# EAGLE design line_sense (EAGLE 5.11)
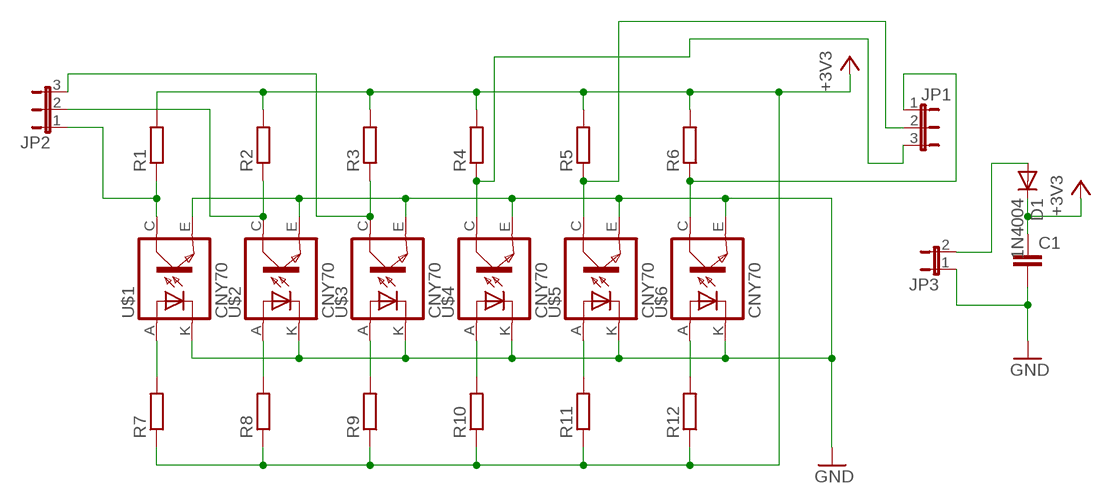
[diagram p0: schematic, sheet 1]

## Parts
C1  C-EUC1206  [C1206]
D1  1N4004  [DO41-10]
JP1  JP2E  [JP2]
JP2  JP2E  [JP2]
JP3  JP1E  [JP1]
R1  R-EU_M1206  [M1206]
R2  R-EU_M1206  [M1206]
R3  R-EU_M1206  [M1206]
R4  R-EU_M1206  [M1206]
R5  R-EU_M1206  [M1206]
R6  R-EU_M1206  [M1206]
R7  R-EU_M1206  [M1206]
R8  R-EU_M1206  [M1206]
R9  R-EU_M1206  [M1206]
R10  R-EU_M1206  [M1206]
R11  R-EU_M1206  [M1206]
R12  R-EU_M1206  [M1206]
U$1  CNY70  [4]
U$2  CNY70  [4]
U$3  CNY70  [4]
U$4  CNY70  [4]
U$5  CNY70  [4]
U$6  CNY70  [4]

## Nets
+3V3: C1.1 D1.C R1.2 R2.2 R3.2 R4.2 R5.2 R6.2 R7.1 R8.1 R9.1 R10.1 R11.1 R12.1
GND: C1.2 JP3.1 U$1.E(EMI) U$1.K(C) U$2.E(EMI) U$2.K(C) U$3.E(EMI) U$3.K(C) U$4.E(EMI) U$4.K(C) U$5.E(EMI) U$5.K(C) U$6.E(EMI) U$6.K(C)
N$2: JP2.2 R2.1 U$2.C(COL)
N$3: JP2.3 R3.1 U$3.C(COL)
N$4: JP1.3 R4.1 U$4.C(COL)
N$5: JP1.2 R5.1 U$5.C(COL)
N$6: JP1.1 R6.1 U$6.C(COL)
N$7: R8.2 U$2.A
N$8: R9.2 U$3.A
N$9: R10.2 U$4.A
N$10: R11.2 U$5.A
N$11: R12.2 U$6.A
N$12: R7.2 U$1.A
N$13: D1.A JP3.2
N$14: JP2.1 R1.1 U$1.C(COL)

## Library data of the parts
C1 = rcl:C-EU: CAPACITOR, European symbol
D1 = diode:1N4004: DIODE general purpose rectifier, 1 A
JP1 JP2 = jumper:JP2E: JUMPER
JP3 = jumper:JP1E: JUMPER
R1-R12 = rcl:R-EU_: RESISTOR, European symbol
U$1-U$6 = cny70:CNY70

## Board
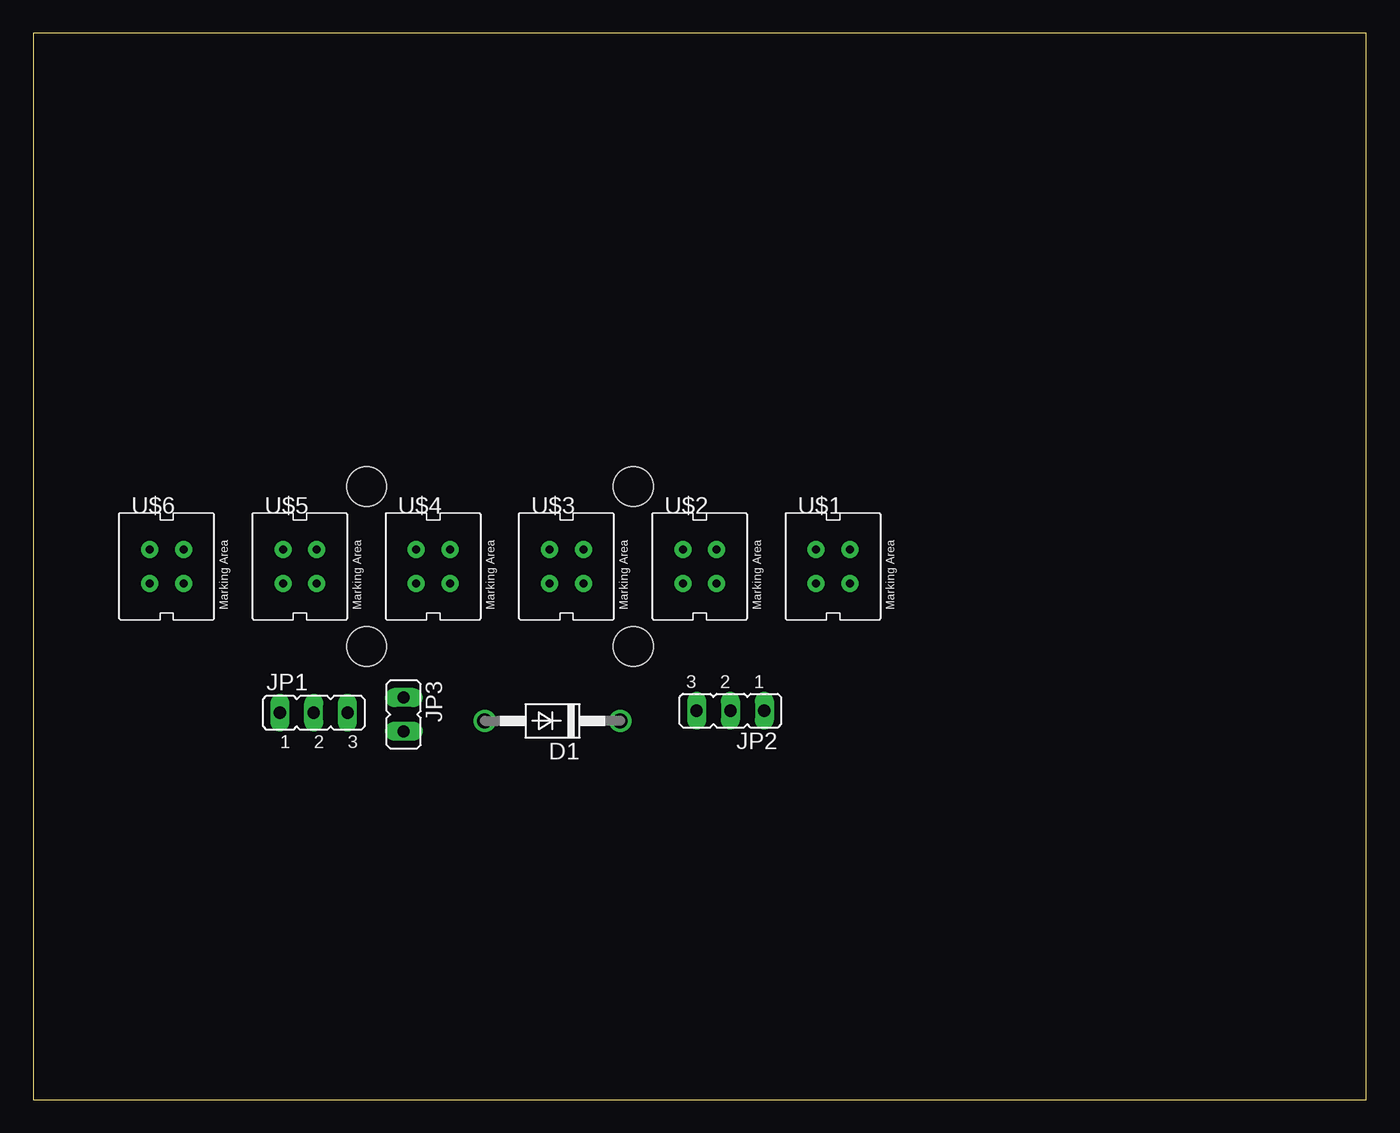
[diagram p1: board, top side]
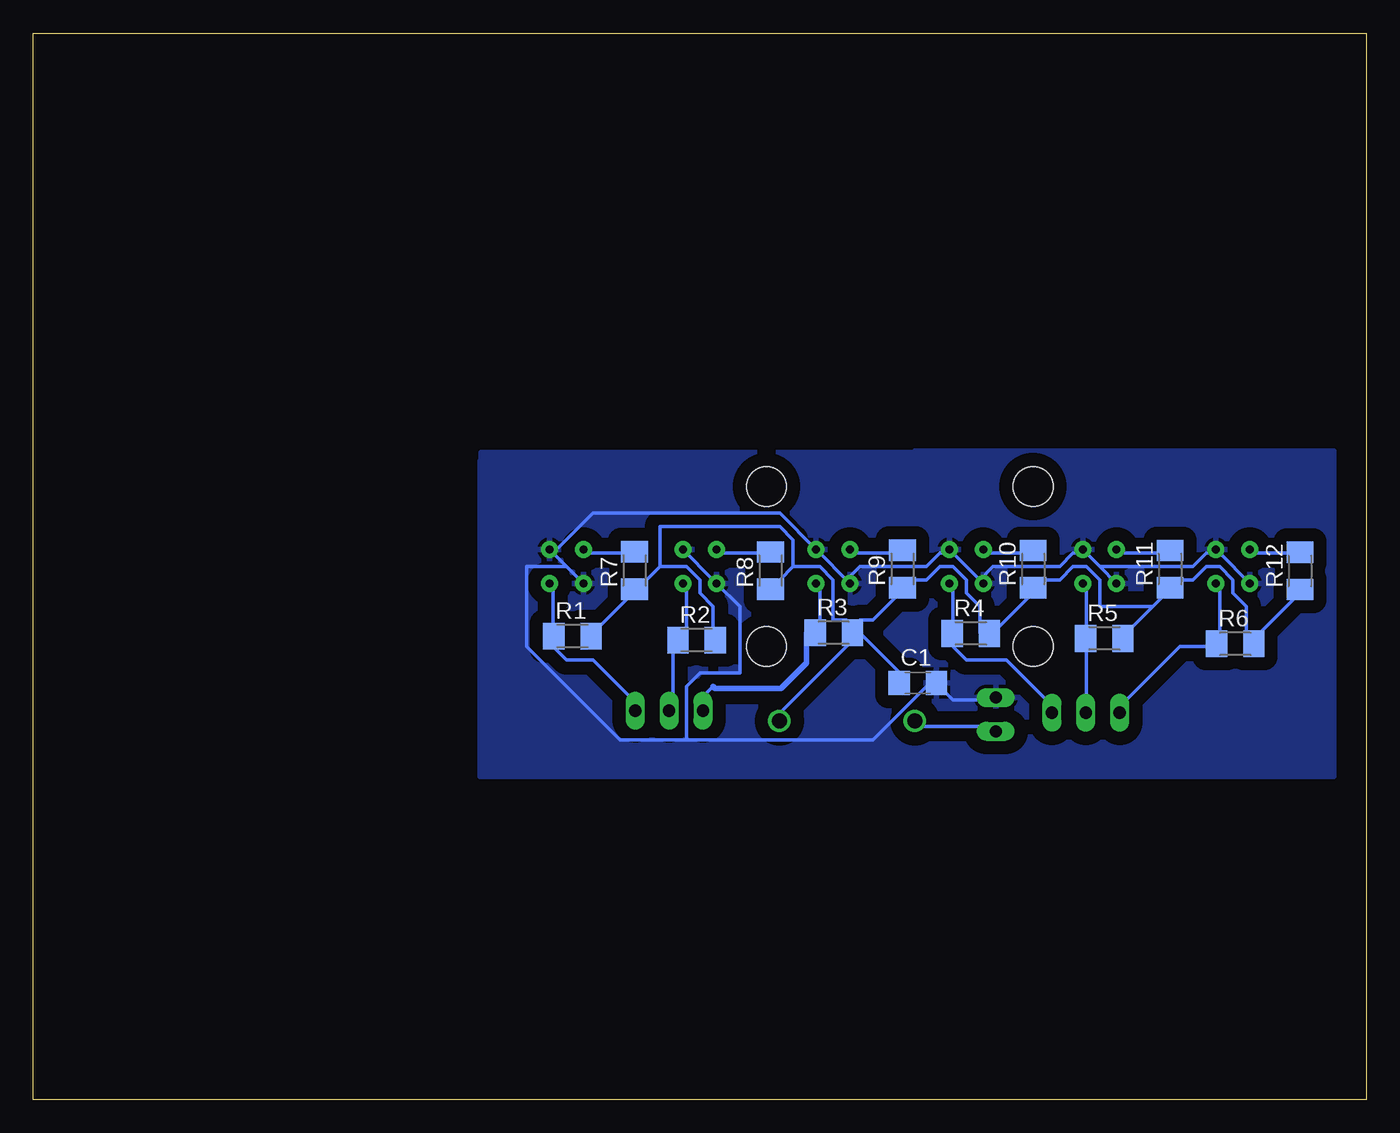
[diagram p2: board, bottom side, seen from below]

Size 100 x 80 mm. Coordinates in mm from the lower left corner, seen from the top.
Outline: 0,0 100,0 100,80 0,80 0,0
Copper layers (1*16): Top 0.035mm / dielectric 1.5mm / Bottom 0.035mm
Design rules "default": minimum track width 10mil, minimum drill 24mil, track to track 8mil, track to pad 8mil, pad to pad 8mil, via to via 8mil, smd to smd 8mil, copper to edge 40mil, drill to drill 8mil, minimum pad ring 10mil, minimum via ring 8mil, stop-mask expansion 4mil, vias tented up to drill 0mil, thermal gap 10mil
Holes 3 mm at 25,34 45,34 25,46 45,46

### Footprints (pad centres in the part's own frame; a part is rotated, then mirrored left to right if it is on the bottom)
C1206 = smd 1.6 x 1.8: 1 -1.4,0; 2 1.4,0
DO41-10 = drill 1.118 round: A 5.08,0; C -5.08,0
JP2 = drill 0.914 long: 1 -2.54,0; 2 0,0; 3 2.54,0
JP1 = drill 0.914 long: 1 0,-1.27; 2 0,1.27
M1206 = smd 1.6 x 2: 1 -1.4,0; 2 1.4,0
4 = drill 0.61 pad 1.27 round: A -1.27,1.27; C 1.27,-1.27; E 1.27,1.27; K -1.27,-1.27

### Placement (x,y rotation side)
C1  33.65,31.25 0 bottom
D1  38.95,28.41 180 top
JP1  21.04,29.02 0 top
JP2  52.3,29.18 180 top
JP3  27.79,28.89 180 top
R1  59.56,34.77 0 bottom
R2  50.23,34.47 0 bottom
R3  39.95,35.02 0 bottom
R4  29.67,34.97 0 bottom
R5  19.66,34.59 0 bottom
R6  9.83,34.19 0 bottom
R7  54.89,39.7 90 bottom
R8  44.69,39.68 90 bottom
R9  34.79,39.81 90 bottom
R10  24.99,39.79 90 bottom
R11  14.72,39.79 90 bottom
R12  4.97,39.67 90 bottom
U$1  60,40 0 top
U$2  50,40 0 top
U$3  40,40 0 top
U$4  30,40 0 top
U$5  20,40 0 top
U$6  10,40 0 top

### Tracks (layer width: path | path; a pad name or v marks a point on that pad's centre or on a via)
+3V3
  Bottom 0.254: R12.1 5,38 8,35 R6.2 9,35 9,37 10,38 10,39 11,40 12,40 13,39 14,39 R11.1 15,38 16,37 | 16,37 18,35 R5.2 | 16,37 20,37 20,39 21,40 22,40 23,39 24,39 R10.1 25,38 28,35 R4.2 29,35 29,37 30,38 30,39 31,40 32,40 33,39 34,39 R9.1 35,38 37,36 38,36 R3.2 | 53,40 51,40 50,39 50,38 49,37 49,35 R2.2 | 53,40 54,39 R7.1 55,38 58,35 R1.2 | 38,35 35,32 C1.1 | 43,40 44,39 R8.1 | 43,40 41,40 40,39 40,36 39,36 R3.2 | 38,35 44,29 D1.C | R3.2 38,35 | 53,40 53,43 44,43 43,42 43,40
GND
  Bottom 0.254: 39,39 41,41 U$3.E 44,44 58,44 61,41 | 29,39 31,41 | U$6.K 11,41 | 20,40 21,41 | 20,40 U$5.K | 11,41 12,41 13,40 20,40 | 11,41 U$6.E | 29,39 28,40 23,40 22,41 21,41 | 29,39 U$4.K | 21,41 U$5.E | 39,39 38,40 33,40 32,41 31,41 | 39,39 U$3.K | 31,41 U$4.E | U$2.E 49,39 U$2.K 47,37 47,32 50,32 51,31 51,27 | JP3.1 28,30 31,30 C1.2 33,31 37,27 51,27 | 61,41 60,40 | 60,40 U$1.K | 51,27 56,27 63,34 63,40 60,40 | 61,41 U$1.E
  pour Bottom (isolate 1): 33.85,48.65 2.45,48.65 2.45,24.25 66.5,24.25 66.5,47.9 66.4,47.9 66.4,48.55 33.85,48.55
N$2
  Bottom 0.254: U$2.C 51,39 51,35 R2.1 52,34 52,30 JP2.2
N$3
  Bottom 0.254: U$3.C 41,39 41,36 R3.1 42,35 | 49,31 50,30 JP2.3
  Bottom 0.406: 42,35 42,32.75 43.9,30.85 48.85,30.85 49,31
N$4
  Bottom 0.254: U$4.C 31,39 31,35 R4.1 31,34 30,33 27,33 24,30 JP1.3
N$5
  Bottom 0.254: U$5.C 21,39 21,35 R5.1 21,34 21,30 JP1.2
N$6
  Bottom 0.254: U$6.C 11,39 11,35 R6.1 12,34 14,34 18,30 JP1.1
N$7
  Bottom 0.254: R8.2 45,41 49,41 U$2.A
N$8
  Bottom 0.254: R9.2 35,41 39,41 U$3.A
N$9
  Bottom 0.254: R10.2 25,41 29,41 U$4.A
N$10
  Bottom 0.254: R11.2 15,41 19,41 U$5.A
N$11
  Bottom 0.254: R12.2 5,41 9,41 U$6.A
N$12
  Bottom 0.254: R7.2 55,41 59,41 U$1.A
N$13
  Bottom 0.254: JP3.2 28,28 34,28 D1.A
N$14
  Bottom 0.254: U$1.C 61,39 61,35 R1.1 61,34 60,33 58,33 55,30 JP2.1
(copper drawn outside any net)
  shapes: Bottom circle x4